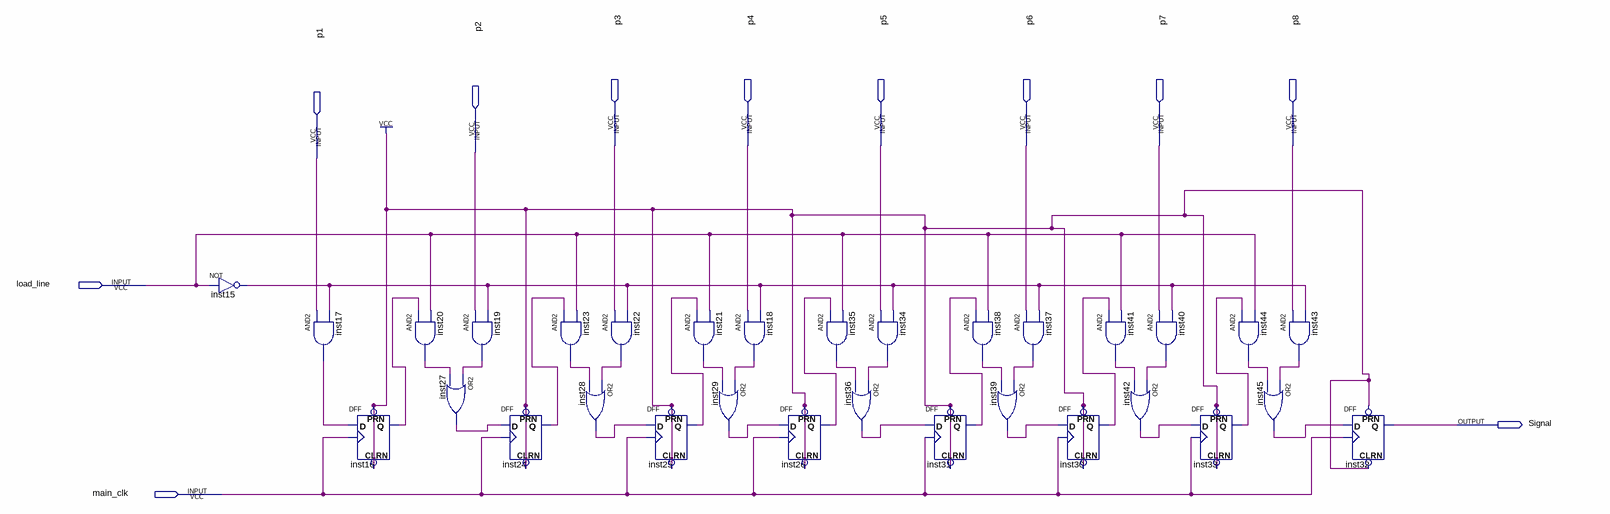
[diagram p0: schematic sheet]
// Quartus schematic piso.bdf as structural Verilog: 31 symbols, 11 pins
module piso (
  input  p3,
  input  p4,
  input  p5,
  input  p6,
  input  p7,
  input  p8,
  input  p2,
  input  p1,
  input  load_line,
  input  main_clk,
  output Signal
);

  wire inst15_out, inst16_q, inst17_out, inst18_out, inst19_out, inst20_out, inst21_out, inst22_out,
       inst23_out, inst24_q, inst25_q, inst26_q, inst27_out, inst28_out, inst29_out, inst30_q, inst31_q,
       inst33_q, inst34_out, inst35_out, inst36_out, inst37_out, inst38_out, inst39_out, inst40_out,
       inst41_out, inst42_out, inst43_out, inst44_out, inst45_out;

  not inst15 (inst15_out, load_line);
  and inst17 (inst17_out, p1, inst15_out);
  DFF inst16 (.CLRN(1'b1), .CLK(main_clk), .D(inst17_out), .PRN(1'b1), .Q(inst16_q));
  and inst20 (inst20_out, inst16_q, load_line);
  and inst19 (inst19_out, p2, inst15_out);
  or inst27 (inst27_out, inst19_out, inst20_out);
  DFF inst24 (.CLRN(1'b1), .CLK(main_clk), .D(inst27_out), .PRN(1'b1), .Q(inst24_q));
  and inst23 (inst23_out, inst24_q, load_line);
  and inst22 (inst22_out, p3, inst15_out);
  or inst28 (inst28_out, inst22_out, inst23_out);
  DFF inst25 (.CLRN(1'b1), .CLK(main_clk), .D(inst28_out), .PRN(1'b1), .Q(inst25_q));
  and inst21 (inst21_out, inst25_q, load_line);
  or inst29 (inst29_out, inst18_out, inst21_out);
  and inst18 (inst18_out, p4, inst15_out);
  and inst35 (inst35_out, inst26_q, load_line);
  DFF inst26 (.CLRN(1'b1), .CLK(main_clk), .D(inst29_out), .PRN(1'b1), .Q(inst26_q));
  and inst34 (inst34_out, p5, inst15_out);
  or inst36 (inst36_out, inst34_out, inst35_out);
  and inst38 (inst38_out, inst31_q, load_line);
  DFF inst31 (.CLRN(1'b1), .CLK(main_clk), .D(inst36_out), .PRN(1'b1), .Q(inst31_q));
  and inst37 (inst37_out, p6, inst15_out);
  or inst39 (inst39_out, inst37_out, inst38_out);
  DFF inst30 (.CLRN(1'b1), .CLK(main_clk), .D(inst39_out), .PRN(1'b1), .Q(inst30_q));
  and inst41 (inst41_out, inst30_q, load_line);
  or inst42 (inst42_out, inst40_out, inst41_out);
  and inst40 (inst40_out, p7, inst15_out);
  DFF inst33 (.CLRN(1'b1), .CLK(main_clk), .D(inst42_out), .PRN(1'b1), .Q(inst33_q));
  and inst44 (inst44_out, inst33_q, load_line);
  or inst45 (inst45_out, inst43_out, inst44_out);
  and inst43 (inst43_out, p8, inst15_out);
  DFF inst32 (.CLRN(1'b1), .CLK(main_clk), .D(inst45_out), .PRN(1'b1), .Q(Signal));
endmodule
